# EAGLE schematic detector (EAGLE 9.5.2)
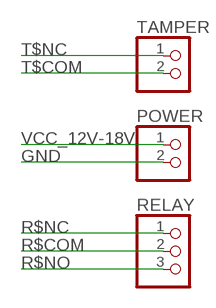
[diagram p0: schematic, sheet 1]

## Parts
POWER  PINHD-1X2  [1X02]
RELAY  PINHD-1X3  [1X03]
TAMPER  PINHD-1X2  [1X02]

## Nets
GND: POWER.2
R$COM: RELAY.2
R$NC: RELAY.1
R$NO: RELAY.3
T$COM: TAMPER.2
T$NC: TAMPER.1
VCC_12V-18V: POWER.1

## Library data of the parts
POWER TAMPER = pinhead:PINHD-1X2: PIN HEADER
RELAY = pinhead:PINHD-1X3: PIN HEADER